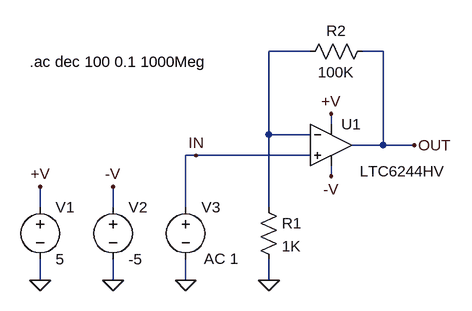
[diagram p0: schematic Fig_1-78_LTC6244HV.asc]
Fig_1-78_LTC6244HV.asc, the LTspice schematic file:
Version 4
SHEET 1 880 680
WIRE 240 -16 176 -16
WIRE 352 -16 320 -16
WIRE 272 96 272 80
WIRE 176 112 176 -16
WIRE 240 112 176 112
WIRE 352 128 352 -16
WIRE 352 128 304 128
WIRE 400 128 352 128
WIRE 64 144 48 144
WIRE 240 144 64 144
WIRE 272 176 272 160
WIRE -176 224 -176 192
WIRE -64 224 -64 192
WIRE 48 224 48 144
WIRE 176 224 176 112
WIRE -176 336 -176 304
WIRE -64 336 -64 304
WIRE 48 336 48 304
WIRE 176 336 176 304
FLAG -64 192 -V
FLAG 272 176 -V
FLAG 272 80 +V
FLAG -176 192 +V
FLAG 400 128 OUT
FLAG -176 336 0
FLAG -64 336 0
FLAG 48 336 0
FLAG 176 336 0
FLAG 64 144 IN
SYMBOL voltage -176 208 R0
WINDOW 123 0 0 Left 2
WINDOW 39 0 0 Left 2
SYMATTR InstName V1
SYMATTR Value 5
SYMBOL voltage -64 208 R0
WINDOW 123 0 0 Left 2
WINDOW 39 0 0 Left 2
SYMATTR InstName V2
SYMATTR Value -5
SYMBOL voltage 48 208 R0
WINDOW 123 28 95 Left 2
WINDOW 39 0 0 Left 2
SYMATTR Value2 AC 1
SYMATTR InstName V3
SYMATTR Value ""
SYMBOL Opamps\\LTC6244HV 272 128 R0
WINDOW 3 44 40 Left 2
SYMATTR InstName U1
SYMBOL res 160 208 R0
SYMATTR InstName R1
SYMATTR Value 1K
SYMBOL res 224 0 R270
WINDOW 0 32 56 VTop 2
WINDOW 3 0 56 VBottom 2
SYMATTR InstName R2
SYMATTR Value 100K
TEXT -192 0 Left 2 !.ac dec 100 0.1 1000Meg

The netlist it stands for:
* Fig_1-78_LTC6244HV.asc
V1 +V 0 5
V2 -V 0 -5
V3 IN 0 AC 1
XU1 IN N001 +V -V OUT LTC6244HV  ; pins In+ In- V+ V- OUT
R1 N001 0 1K
R2 N001 OUT 100K
.ac dec 100 0.1 1000Meg
.lib LTC5.lib
.backanno
.end